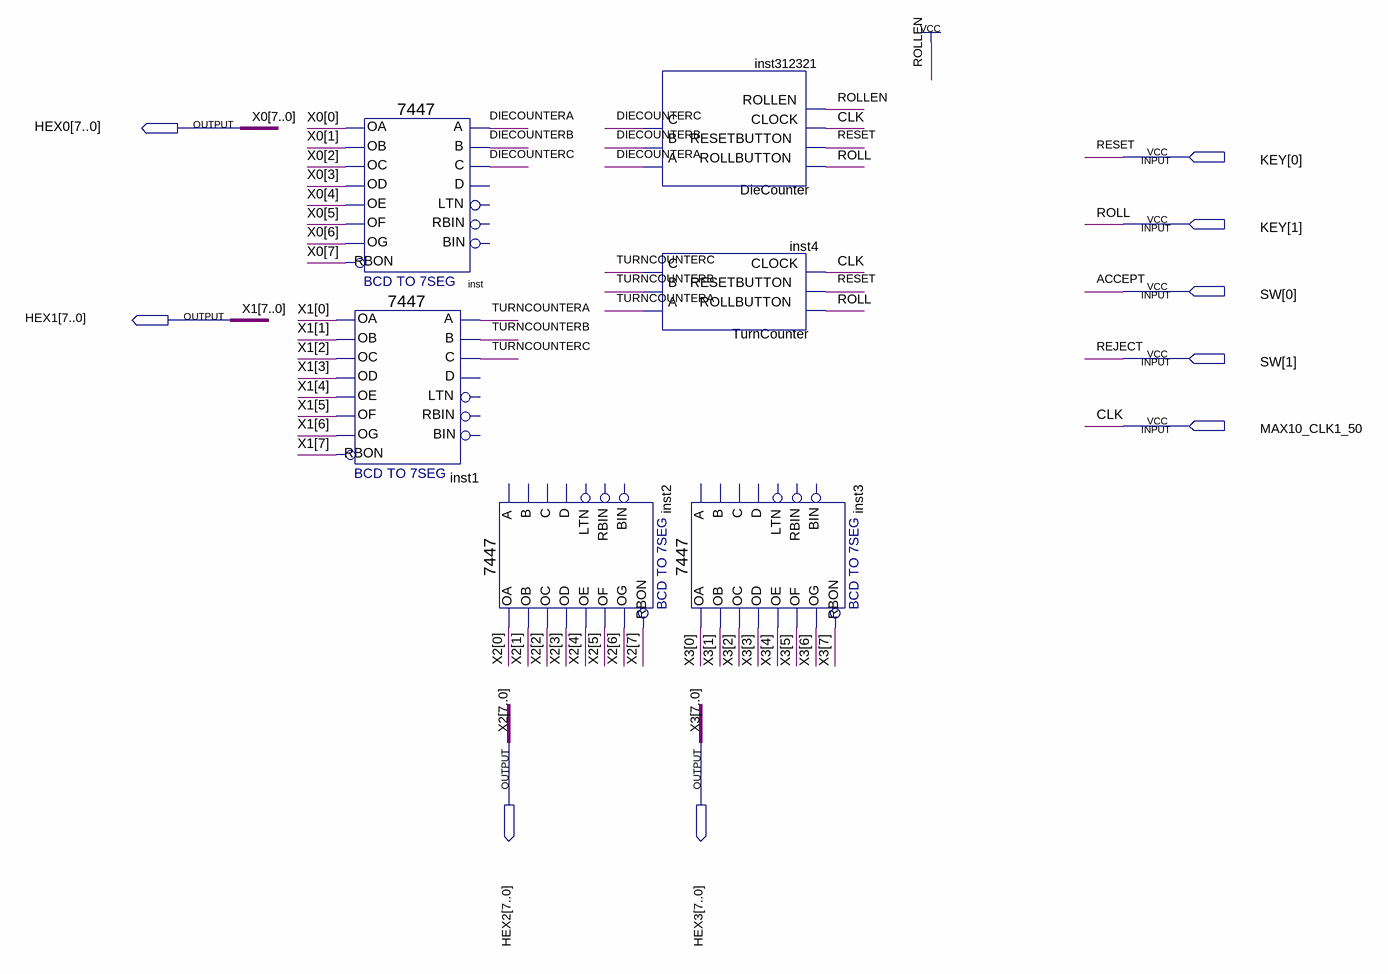
[diagram p0: schematic sheet]
// Quartus schematic lab6.bdf as structural Verilog: 6 symbols, 9 pins
module lab6 (
  input  [1:0] KEY,
  input  [1:0] SW,
  input  MAX10_CLK1_50,
  output [7:0] HEX0,
  output [7:0] HEX1,
  output [7:0] HEX2,
  output [7:0] HEX3
);

  wire DIECOUNTERA, DIECOUNTERB, DIECOUNTERC, TURNCOUNTERA, TURNCOUNTERB, TURNCOUNTERC;

  \7447  inst1 (
    .B(TURNCOUNTERB), .C(TURNCOUNTERC), .A(TURNCOUNTERA), .OB(HEX1[1]), .OC(HEX1[2]), .OE(HEX1[4]),
    .OD(HEX1[3]), .OF(HEX1[5]), .OG(HEX1[6]), .OA(HEX1[0]), .RBON(HEX1[7]));  // open: LTN, D, RBIN, BIN
  \7447  inst (
    .B(DIECOUNTERB), .C(DIECOUNTERC), .A(DIECOUNTERA), .OB(HEX0[1]), .OC(HEX0[2]), .OE(HEX0[4]),
    .OD(HEX0[3]), .OF(HEX0[5]), .OG(HEX0[6]), .OA(HEX0[0]), .RBON(HEX0[7]));  // open: LTN, D, RBIN, BIN
  \7447  inst2 (
    .OB(HEX2[1]), .OC(HEX2[2]), .OE(HEX2[4]), .OD(HEX2[3]), .OF(HEX2[5]), .OG(HEX2[6]), .OA(HEX2[0]),
    .RBON(HEX2[7]));  // open: LTN, B, C, D, RBIN, BIN, A
  DieCounter inst312321 (
    .ROLLBUTTON(KEY[1]), .RESETBUTTON(KEY[0]), .CLOCK(MAX10_CLK1_50), .ROLLEN(1'b1), .A(DIECOUNTERA),
    .B(DIECOUNTERB), .C(DIECOUNTERC));
  TurnCounter inst4 (
    .ROLLBUTTON(KEY[1]), .RESETBUTTON(KEY[0]), .CLOCK(MAX10_CLK1_50), .A(TURNCOUNTERA), .B(TURNCOUNTERB),
    .C(TURNCOUNTERC));
  \7447  inst3 (
    .OB(HEX3[1]), .OC(HEX3[2]), .OE(HEX3[4]), .OD(HEX3[3]), .OF(HEX3[5]), .OG(HEX3[6]), .OA(HEX3[0]),
    .RBON(HEX3[7]));  // open: LTN, B, C, D, RBIN, BIN, A

  // Other names for the same wires on the sheet: ACCEPT = SW[0]; CLK = MAX10_CLK1_50; REJECT = SW[1]; RESET = KEY[0];
  //   ROLL = KEY[1]; X0[7:0] = HEX0; X1[7:0] = HEX1; X2[7:0] = HEX2; X3[7:0] = HEX3
endmodule
